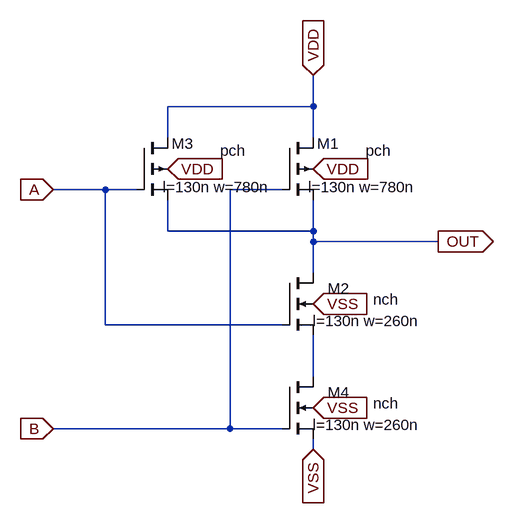
[diagram p0: schematic Nand2.asc]
Nand2.asc, the LTspice schematic file:
Version 4.1
SHEET 1 880 680
WIRE 128 -160 128 -208
WIRE 128 -160 -96 -160
WIRE -96 -112 -96 -160
WIRE 128 -112 128 -160
WIRE -192 -32 -272 -32
WIRE -144 -32 -192 -32
WIRE 80 -32 0 -32
WIRE -96 32 -96 -16
WIRE 128 32 128 -16
WIRE 128 32 -96 32
WIRE 128 48 128 32
WIRE 320 48 128 48
WIRE 128 96 128 48
WIRE -192 176 -192 -32
WIRE 80 176 -192 176
WIRE 128 256 128 192
WIRE 0 336 0 -32
WIRE 0 336 -272 336
WIRE 80 336 0 336
WIRE 128 368 128 352
FLAG -96 -64 VDD
IOPIN -96 -64 In
FLAG 128 -64 VDD
IOPIN 128 -64 In
FLAG 128 144 VSS
IOPIN 128 144 In
FLAG 128 304 VSS
IOPIN 128 304 In
FLAG 128 368 VSS
IOPIN 128 368 In
FLAG 128 -208 VDD
IOPIN 128 -208 In
FLAG -272 -32 A
IOPIN -272 -32 In
FLAG -272 336 B
IOPIN -272 336 In
FLAG 320 48 OUT
IOPIN 320 48 Out
SYMBOL pmos4 80 -112 R0
WINDOW 0 88 9 Right 2
WINDOW 3 168 20 Right 2
WINDOW 123 206 76 Right 2
SYMATTR InstName M1
SYMATTR Value pch
SYMATTR Value2 l=130n w=780n
SYMBOL nmos4 80 96 R0
WINDOW 0 104 24 Right 2
WINDOW 3 179 41 Right 2
WINDOW 123 213 74 Right 2
SYMATTR InstName M2
SYMATTR Value nch
SYMATTR Value2 l=130n w=260n
SYMBOL pmos4 -144 -112 R0
WINDOW 0 88 9 Right 2
WINDOW 3 168 20 Right 2
WINDOW 123 206 76 Right 2
SYMATTR InstName M3
SYMATTR Value pch
SYMATTR Value2 l=130n w=780n
SYMBOL nmos4 80 256 R0
WINDOW 0 104 24 Right 2
WINDOW 3 179 41 Right 2
WINDOW 123 213 74 Right 2
SYMATTR InstName M4
SYMATTR Value nch
SYMATTR Value2 l=130n w=260n

The netlist it stands for:
* Nand2.asc
M1 VDD B OUT VDD pch l=130n w=780n
M2 OUT A N001 VSS nch l=130n w=260n
M3 VDD A OUT VDD pch l=130n w=780n
M4 N001 B VSS VSS nch l=130n w=260n
.model NMOS NMOS
.model PMOS PMOS
.lib standard.mos
.backanno
.end